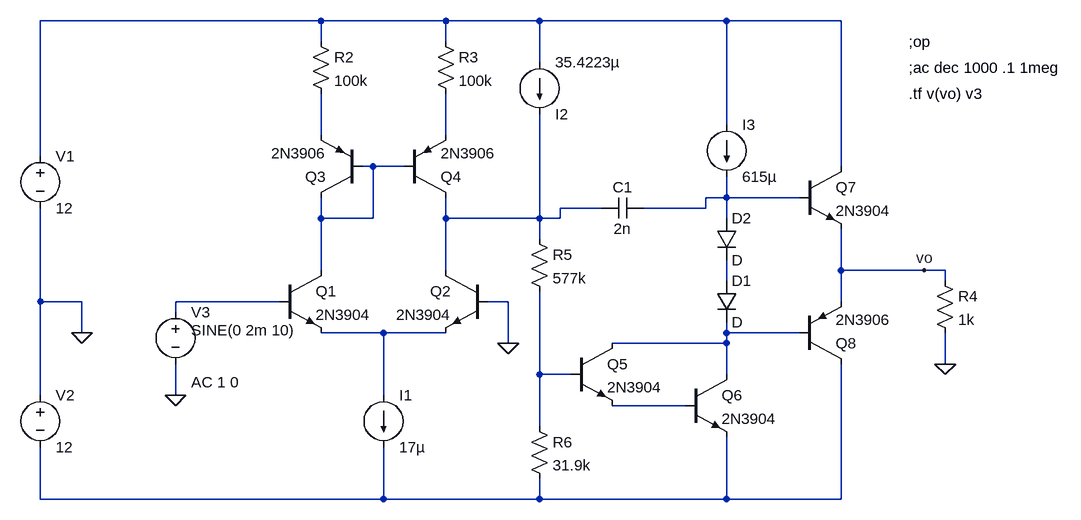
[diagram p0: schematic op_gen.asc]
op_gen.asc, the LTspice schematic file:
Version 4
SHEET 1 1632 680
WIRE 112 -256 -320 -256
WIRE 304 -256 112 -256
WIRE 448 -256 304 -256
WIRE 736 -256 448 -256
WIRE 912 -256 736 -256
WIRE 112 -224 112 -256
WIRE 304 -224 304 -256
WIRE 448 -192 448 -256
WIRE 736 -96 736 -256
WIRE 112 -80 112 -144
WIRE 304 -80 304 -144
WIRE -320 -48 -320 -256
WIRE 192 -32 176 -32
WIRE 240 -32 192 -32
WIRE 912 -32 912 -256
WIRE 736 16 736 -16
WIRE 736 16 704 16
WIRE 848 16 736 16
WIRE 544 32 480 32
WIRE 704 32 704 16
WIRE 704 32 608 32
WIRE 112 48 112 16
WIRE 192 48 192 -32
WIRE 192 48 112 48
WIRE 304 48 304 16
WIRE 448 48 448 -112
WIRE 448 48 304 48
WIRE 480 48 480 32
WIRE 480 48 448 48
WIRE 736 48 736 16
WIRE 112 64 112 48
WIRE 448 80 448 48
WIRE 112 128 112 64
WIRE 304 128 304 48
WIRE 912 128 912 64
WIRE 944 128 912 128
WIRE 1040 128 944 128
WIRE 1072 128 1040 128
WIRE 736 144 736 112
WIRE 1072 144 1072 128
WIRE -320 176 -320 32
WIRE -256 176 -320 176
WIRE 48 176 -112 176
WIRE 400 176 368 176
WIRE 912 176 912 128
WIRE -112 192 -112 176
WIRE -256 224 -256 176
WIRE 208 224 112 224
WIRE 304 224 208 224
WIRE 448 224 448 160
WIRE 736 224 736 208
WIRE 848 224 736 224
WIRE 400 240 400 176
WIRE 736 240 736 224
WIRE 736 240 560 240
WIRE 1072 272 1072 224
WIRE 448 288 448 224
WIRE 496 288 448 288
WIRE 736 288 736 240
WIRE -320 320 -320 176
WIRE -112 320 -112 272
WIRE 208 320 208 224
WIRE 672 336 560 336
WIRE 448 368 448 288
WIRE -320 480 -320 400
WIRE 208 480 208 400
WIRE 208 480 -320 480
WIRE 448 480 448 448
WIRE 448 480 208 480
WIRE 736 480 736 384
WIRE 736 480 448 480
WIRE 912 480 912 272
WIRE 912 480 736 480
FLAG 400 240 0
FLAG -112 320 0
FLAG -256 224 0
FLAG 1072 272 0
FLAG 1040 128 vo
DATAFLAG 304 48 ""
DATAFLAG 112 64 ""
DATAFLAG 944 128 ""
DATAFLAG 448 224 ""
SYMBOL npn 48 128 R0
SYMATTR InstName Q1
SYMATTR Value 2N3904
SYMBOL npn 368 128 M0
SYMATTR InstName Q2
SYMATTR Value 2N3904
SYMBOL pnp 176 16 R180
SYMATTR InstName Q3
SYMATTR Value 2N3906
SYMBOL pnp 240 16 M180
SYMATTR InstName Q4
SYMATTR Value 2N3906
SYMBOL current 208 320 R0
WINDOW 123 0 0 Left 2
WINDOW 39 0 0 Left 2
SYMATTR InstName I1
SYMATTR Value 17µ
SYMBOL npn 496 240 R0
SYMATTR InstName Q5
SYMATTR Value 2N3904
SYMBOL npn 672 288 R0
SYMATTR InstName Q6
SYMATTR Value 2N3904
SYMBOL diode 720 144 R0
SYMATTR InstName D1
SYMBOL diode 720 48 R0
SYMATTR InstName D2
SYMBOL current 736 -96 R0
WINDOW 123 0 0 Left 2
WINDOW 39 0 0 Left 2
SYMATTR InstName I3
SYMATTR Value 615µ
SYMBOL npn 848 -32 R0
SYMATTR InstName Q7
SYMATTR Value 2N3904
SYMBOL pnp 848 272 M180
SYMATTR InstName Q8
SYMATTR Value 2N3906
SYMBOL voltage -320 -64 R0
WINDOW 123 0 0 Left 2
WINDOW 39 0 0 Left 2
SYMATTR InstName V1
SYMATTR Value 12
SYMBOL voltage -320 304 R0
WINDOW 123 0 0 Left 2
WINDOW 39 0 0 Left 2
SYMATTR InstName V2
SYMATTR Value 12
SYMBOL res 96 -240 R0
SYMATTR InstName R2
SYMATTR Value 100k
SYMBOL res 288 -240 R0
SYMATTR InstName R3
SYMATTR Value 100k
SYMBOL current 448 -192 R0
WINDOW 0 24 80 Left 2
WINDOW 3 24 0 Left 2
WINDOW 123 0 0 Left 2
WINDOW 39 0 0 Left 2
SYMATTR InstName I2
SYMATTR Value 35.4223µ
SYMBOL res 1056 128 R0
SYMATTR InstName R4
SYMATTR Value 1k
SYMBOL res 432 64 R0
SYMATTR InstName R5
SYMATTR Value 577k
SYMBOL res 432 352 R0
SYMATTR InstName R6
SYMATTR Value 31.9k
SYMBOL voltage -112 176 R0
WINDOW 123 24 124 Left 2
WINDOW 39 0 0 Left 2
WINDOW 3 24 44 Left 2
SYMATTR Value2 AC 1 0
SYMATTR Value SINE(0 2m 10)
SYMATTR InstName V3
SYMBOL cap 608 16 R90
WINDOW 0 0 32 VBottom 2
WINDOW 3 32 32 VTop 2
SYMATTR InstName C1
SYMATTR Value 2n
TEXT 1016 -224 Left 2 !;op
TEXT 1016 -184 Left 2 !;ac dec 1000 .1 1meg
TEXT 1016 -144 Left 2 !.tf v(vo) v3

The netlist it stands for:
* op_gen.asc
Q1 N004 N008 N009 0 2N3904
Q2 N006 0 N009 0 2N3904
Q3 N004 N004 N002 0 2N3906
Q4 N006 N004 N003 0 2N3906
I1 N009 N013 17µ
Q5 N011 N010 N012 0 2N3904
Q6 N011 N012 N013 0 2N3904
D1 N007 N011 D
D2 N005 N007 D
I3 N001 N005 615µ
Q7 N001 N005 vo 0 2N3904
Q8 N013 N011 vo 0 2N3906
V1 N001 0 12
V2 0 N013 12
R2 N001 N002 100k
R3 N001 N003 100k
I2 N001 N006 35.4223µ
R4 vo 0 1k
R5 N006 N010 577k
R6 N010 N013 31.9k
V3 N008 0 SINE(0 2m 10) AC 1 0
C1 N005 N006 2n
.model D D
.lib standard.dio
.model NPN NPN
.model PNP PNP
.lib standard.bjt
;op
;ac dec 1000 .1 1meg
.tf v(vo) v3
.backanno
.end